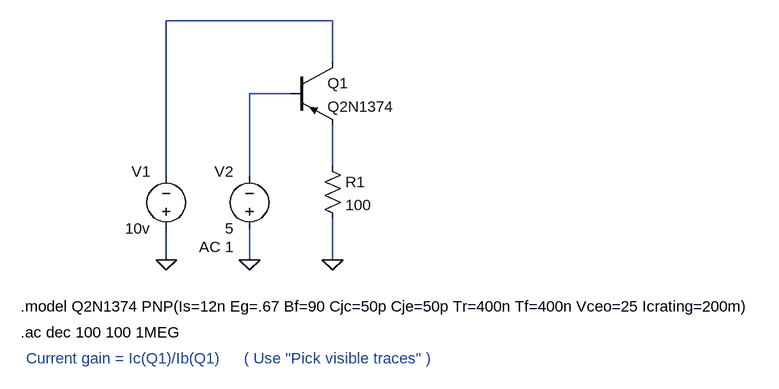
[diagram p0: schematic PNPbetaTest.asc]
PNPbetaTest.asc, the LTspice schematic file:
Version 4
SHEET 1 1112 680
WIRE 112 16 -144 16
WIRE 112 80 112 16
WIRE 48 128 -16 128
WIRE 112 240 112 176
WIRE -144 256 -144 16
WIRE -16 256 -16 128
WIRE -144 384 -144 336
WIRE -16 384 -16 336
WIRE 112 384 112 320
FLAG -144 384 0
FLAG 112 384 0
FLAG -16 384 0
SYMBOL pnp 48 80 R0
SYMATTR InstName Q1
SYMATTR Value Q2N1374
SYMBOL voltage -144 352 R180
WINDOW 0 24 104 Left 0
WINDOW 3 24 16 Left 0
SYMATTR InstName V1
SYMATTR Value 10v
SYMBOL res 96 224 R0
SYMATTR InstName R1
SYMATTR Value 100
SYMBOL voltage -16 352 R180
WINDOW 0 24 104 Left 0
WINDOW 3 24 16 Left 0
WINDOW 123 24 -12 Left 0
WINDOW 39 0 0 Left 0
SYMATTR InstName V2
SYMATTR Value 5
SYMATTR Value2 AC 1
TEXT -368 456 Left 0 !.model Q2N1374 PNP(Is=12n Eg=.67 Bf=90 Cjc=50p Cje=50p Tr=400n Tf=400n Vceo=25 Icrating=200m)
TEXT -368 496 Left 0 !.ac dec 100 100 1MEG
TEXT -360 536 Left 0 ;Current gain = Ic(Q1)/Ib(Q1)
TEXT -24 536 Left 0 ;( Use "Pick visible traces" )

The netlist it stands for:
* PNPbetaTest.asc
Q1 N001 N002 N003 0 Q2N1374
V1 0 N001 10v
R1 N003 0 100
V2 0 N002 5 AC 1
.model NPN NPN
.model PNP PNP
.lib standard.bjt
.model Q2N1374 PNP(Is=12n Eg=.67 Bf=90 Cjc=50p Cje=50p Tr=400n Tf=400n Vceo=25 Icrating=200m)
.ac dec 100 100 1MEG
* Current gain = Ic(Q1)/Ib(Q1)
* ( Use "Pick visible traces" )
.backanno
.end